# Altium project Schematic_Temp.PrjPcb
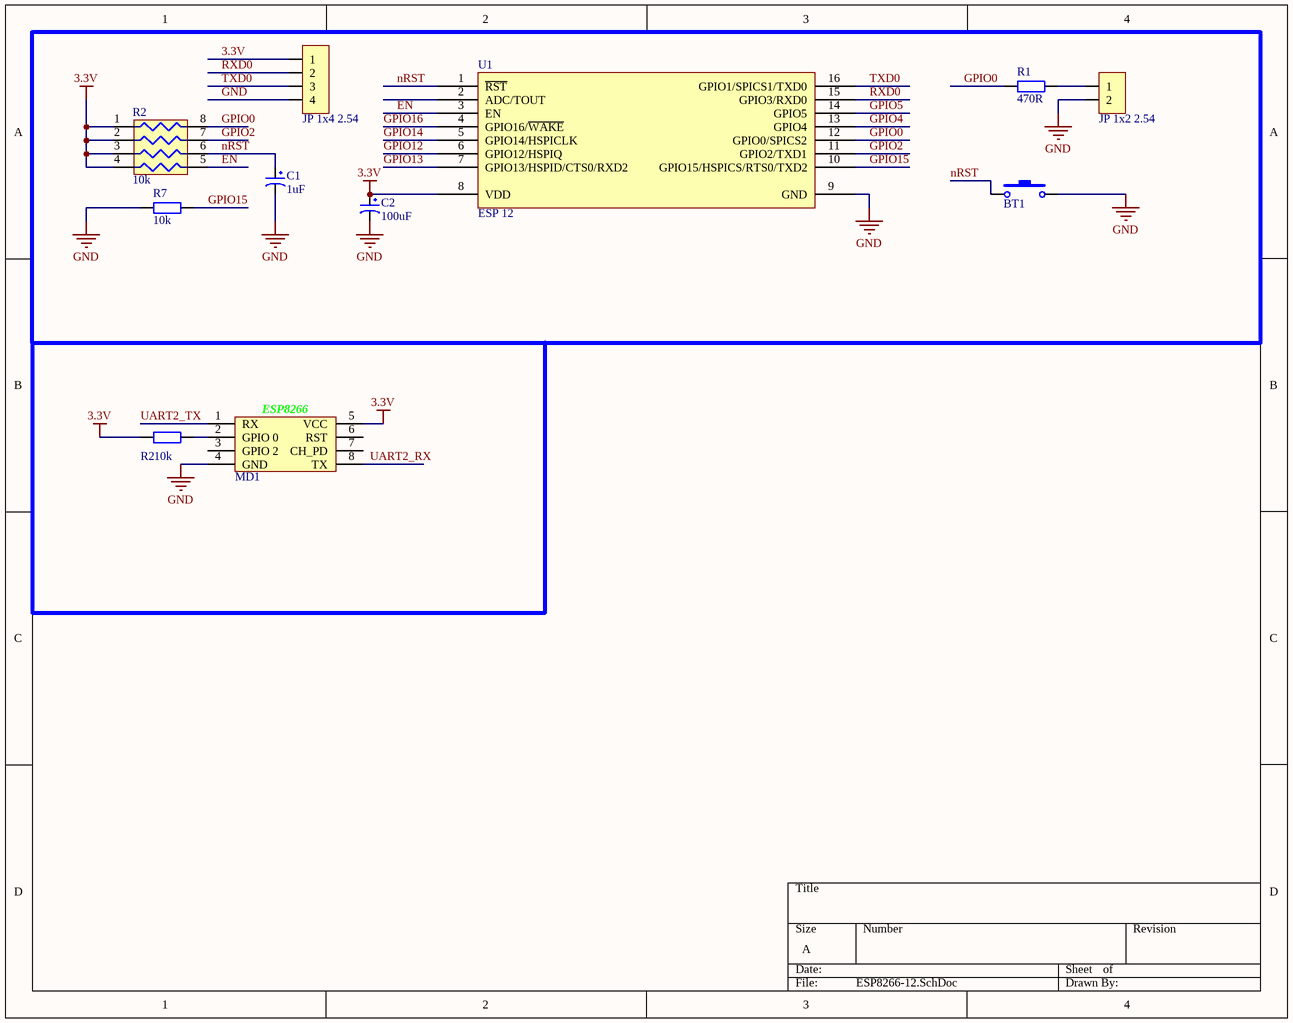
[diagram p0: ESP8266-12.SchDoc]
1 sheet, 11 parts. Net scope: global (net labels, ports and power ports of the same name join across sheets).

## Sheet ESP8266-12.SchDoc
size A; SheetNumber: 1; SheetTotal: 1

### Parts
(Parts that share a designator on the sheet are numbered #1, #2 ... from top to bottom, then left to right.)
BT1  Nut Nhan 2 Chan SMD  [3X6X2.5 SMD]  (value not drawn)
C1  1uF  [tu tantalum smd3216]
C2  100uF  [tu tantalum smd6032]
JP1  JP 1x4 2.54  [JP 1x4 DT]
JP2  JP 1x2 2.54  [JP 1x2 DT]
MD1  ESP8266 Module  [ESP2866 Module]  (value not drawn)
R1  470R  [Tro SMD 0805]
R2#1  10k  [tro bang 0603 4]
R2#2  10k  [tro smd 0805]
R7  10k  [tro smd 0805]
U1  ESP 12  [ESP12]

### Nets
3.3V: C2.1 JP1.1 MD1.5(VCC) R2#1.1 R2#1.2 R2#1.3 R2#1.4 R2#2.2 U1.8(VDD)
GND: BT1.2 C1.2 C2.2 JP1.4 JP2.2 MD1.4(GND) R7.1 U1.9(GND)
EN: R2#1.5 U1.3(EN)
GPIO0: R1.2 R2#1.8 U1.12(GPIO0/SPICS2)
GPIO2: R2#1.7 U1.11(GPIO2/TXD1)
GPIO4: U1.13(GPIO4)
GPIO5: U1.14(GPIO5)
GPIO12: U1.6(GPIO12/HSPIQ)
GPIO13: U1.7(GPIO13/HSPID/CTS0/RXD2)
GPIO14: U1.5(GPIO14/HSPICLK)
GPIO15: R7.2 U1.10(GPIO15/HSPICS/RTS0/TXD2)
GPIO16: U1.4(GPIO16/~{WAKE})
nRST: BT1.1 C1.1 R2#1.6 U1.1(~{RST})
RXD0: JP1.2 U1.15(GPIO3/RXD0)
TXD0: JP1.3 U1.16(GPIO1/SPICS1/TXD0)
UART2_RX: MD1.8(TX)
UART2_TX: MD1.1(RX)
NetJP2_1: JP2.1 R1.1
NetMD1_2: MD1.2(GPIO_0) R2#2.1

Not connected (* = marked no-connect by the designer): MD1 3(GPIO_2) 6(RST) 7(CH_PD); U1 2(ADC/TOUT)

### Notes on the sheet
- (in symbol ESP8266 Module) ESP8266

### Library data of the parts
C1 = Tu tantalum 1uF 25V SMD3216: Dán; Don_Vi: Con; So_Chan: 2; Ten_Linh_Kien: Tụ tantalum 105E-1uF 25V SMD3216; Ma_Hang: MH007472; Chung_Loai: Dán; Kieu_Chan: *
C2 = Tu tantalum 100uF 10V SMD6032: Dán; Don_Vi: Con; So_Chan: 2; Ten_Linh_Kien: Tụ tantalum 107A-100uF 10V SMD6032; Ma_Hang: MH007594; Chung_Loai: Dán; Kieu_Chan: *
JP1 = JP 1x4 2.54 Duc Thang: Cắm; Ten_Linh_Kien: Jump Đơn Đực 2.54MM 1x40P Thẳng 11MM; Don_Vi: Con; Ma_Hang: MH000903; Ghi_Chu: *; Kieu_Chan: *; Chung_Loai: Cắm
JP2 = JP 1x2 2.54 Duc Thang: Cắm; Ten_Linh_Kien: Jump Đơn Đực 2.54MM 1x40P Thẳng 11MM; Don_Vi: Con; Ma_Hang: MH000903; Ghi_Chu: *; Kieu_Chan: *; Chung_Loai: Cắm
R1 = Tro 0805 5% 470R: Dán; Don_Vi: Con; Ma_Hang: MH005341; Ten_Linh_Kien: Trở 0805 5% 470R; So_Chan: 2; Chung_Loai: Dán; Kieu_Chan: *
R2#1 = Tro bang 0603 10k: Dán; Don_Vi: Con; So_Chan: 8; Ten_Linh_Kien: Trở băng 0603x4 10k; Ma_Hang: MH001444; Chung_Loai: Dán; Kieu_Chan: *
R2#2 R7 = Tro 0805 5% 10k: Dán; Don_Vi: Con; So_Chan: 2; Ten_Linh_Kien: Trở 0805 5% 10k; Ma_Hang: MH005239; Chung_Loai: Dán; Kieu_Chan: *
U1 = ESP_12: ESP-12 Wi-Fi Module by AI-Thinker; IC: ESP8266-EX; Vendor: Ai-thinker
BT1 = Nut Nhan 2 Chan SMD: Published: 24-Mar-1999; LatestRevisionDate: 17-Jul-2002; LatestRevisionNote: Re-released for DXP Platform.; PackageReference: SPST-2; Publisher: Altium Limited